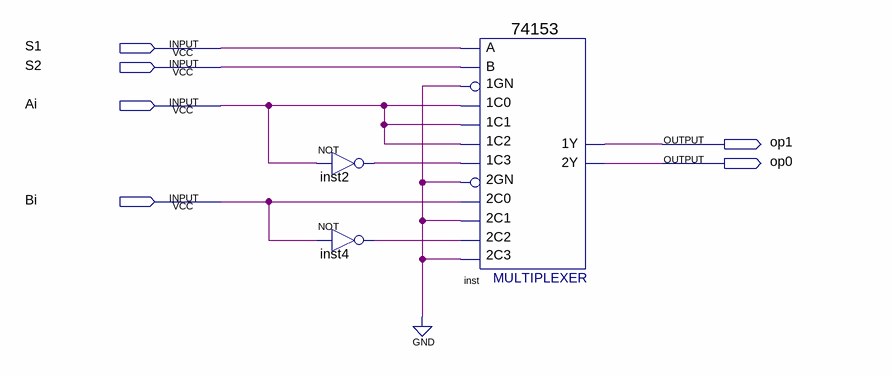
[diagram p0: schematic sheet]
// Quartus schematic operand1bit.bdf as structural Verilog: 3 symbols, 6 pins
module operand1bit (
  input  S1,
  input  S2,
  input  Ai,
  input  Bi,
  output op1,
  output op0
);

  wire inst2_out, inst4_out;

  not inst2 (inst2_out, Ai);
  not inst4 (inst4_out, Bi);
  \74153  inst (
    .\1C1 (Ai), .\1GN (1'b0), .\1C0 (Ai), .\2C0 (Bi), .\2GN (1'b0), .\2C2 (inst4_out), .\1C2 (Ai),
    .\1C3 (inst2_out), .B(S2), .A(S1), .\2C1 (1'b0), .\2C3 (1'b0), .\1Y (op1), .\2Y (op0));
endmodule
